# EAGLE design gimli1_1 (EAGLE 7.6.0)
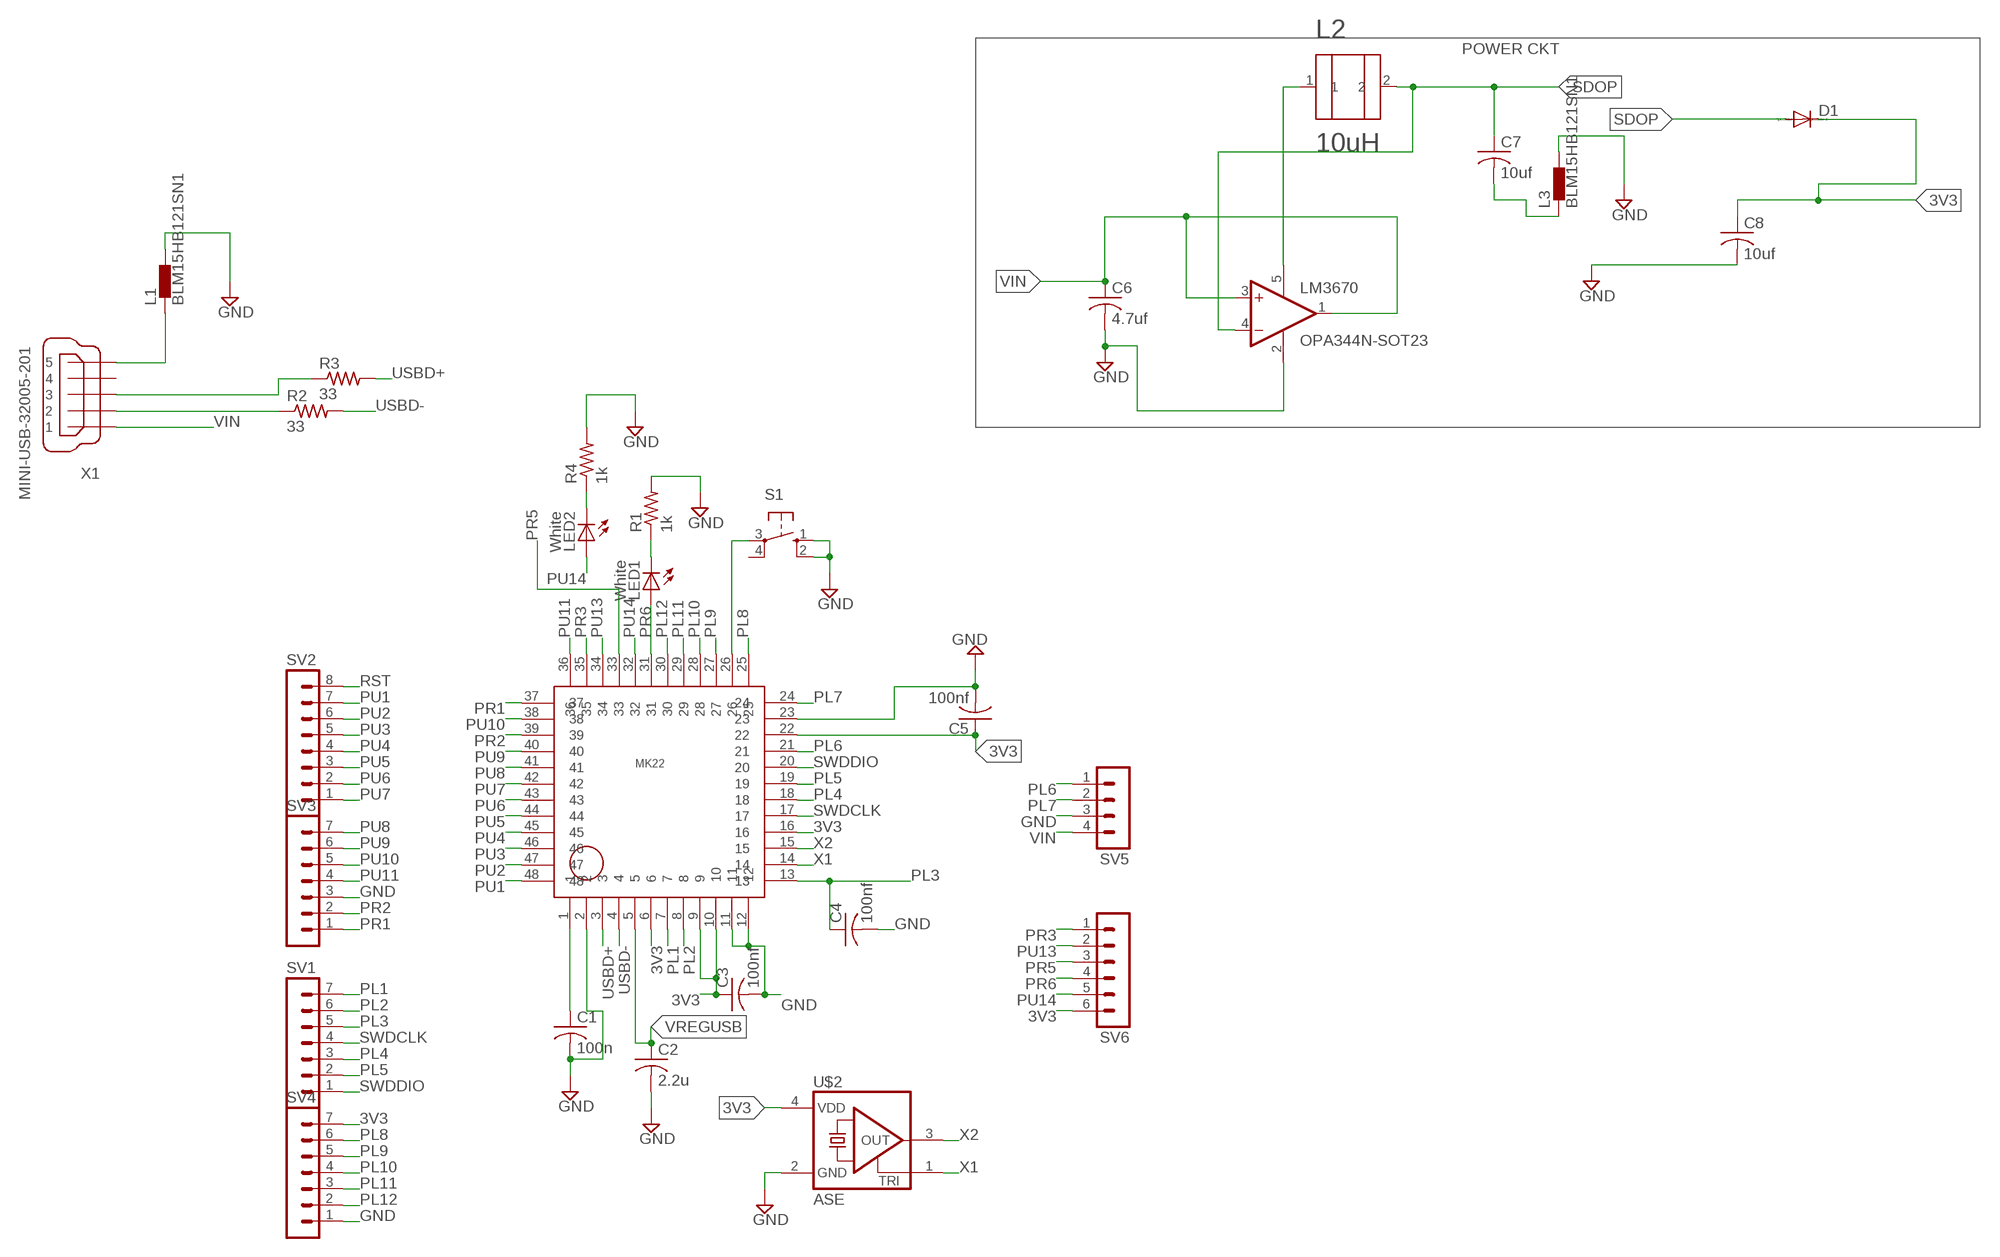
[diagram p0: schematic, sheet 1]

## Parts
C1  100n  C-USC0402  [C0402]
C2  2.2u  C-USC0402  [C0402]
C3  100nf  C-USC0402  [C0402]
C4  100nf  C-USC0402  [C0402]
C5  100nf  C-USC0402  [C0402]
C6  4.7uf  C-USC0402  [C0402]
C7  10uf  C-USC0402  [C0402]
C8  10uf  C-USC0402  [C0402]
D1  DIODE-MICROMELF-W  [MICROMELF-W]
L1  BLM15HB121SN1  [0402]
L2  10uH  INDUCTNEW  [INDUCTNEW]
L3  BLM15HB121SN1  [0402]
LED1  White  LEDSML0603  [SML0603]
LED2  White  LEDSML0603  [SML0603]
LM3670  OPA344N-SOT23  [SOT23-5]
MK22  LQFP48  [LQFP48]
R1  1k  R-US_R0402  [R0402]
R2  33  R-US_R0402  [R0402]
R3  33  R-US_R0402  [R0402]
R4  1k  R-US_R0402  [R0402]
S1  10-XX  [B3F-10XX]
SV1  MA07-1  [MA07-1]
SV2  MA08-1  [MA08-1]
SV3  MA07-1  [MA07-1]
SV4  MA07-1  [MA07-1]
SV5  MA04-1  [MA04-1]
SV6  MA06-1  [MA06-1]
U$2  ASE  [ASE]
X1  MINI-USB-32005-201  [32005-201]

## Nets
3V3: C3.1 C5.1 C8.1 D1.C MK22.6 MK22.9 MK22.10 MK22.16 MK22.22 SV4.7 SV6.6 U$2.4(VDD)
GND: C1.2 C2.2 C3.2 C4.2 C5.2 C6.2 C8.2 L1.1 L1.2 L3.2 LM3670.2(V-) MK22.2 MK22.11 MK22.12 MK22.23 R1.2 R4.2 S1.1(S) S1.2(S1) SV3.3 SV4.1 SV5.3 U$2.2(GND) X1.5
N$1: C1.1 MK22.1
N$3: C7.2 L3.1
N$4: LED1.C R1.1
N$5: LED2.C R4.1
N$6: R2.1 X1.2
N$8: R3.1 X1.3
N$9: L2.1 LM3670.5(V+)
PL1: MK22.7 SV1.7
PL2: MK22.8 SV1.6
PL3: C4.1 MK22.13 SV1.5
PL4: MK22.18 SV1.3
PL5: MK22.19 SV1.2
PL6: MK22.21 SV5.1
PL7: MK22.24 SV5.2
PL8: MK22.25 SV4.6
PL9: MK22.27 SV4.5
PL10: MK22.28 SV4.4
PL11: MK22.29 SV4.3
PL12: MK22.30 SV4.2
PR1: MK22.37 SV3.1
PR2: MK22.39 SV3.2
PR3: MK22.35 SV6.1
PR5: MK22.33 SV6.3
PR6: LED1.A MK22.31 SV6.4
PU1: MK22.48 SV2.7
PU2: MK22.47 SV2.6
PU3: MK22.46 SV2.5
PU4: MK22.45 SV2.4
PU5: MK22.44 SV2.3
PU6: MK22.43 SV2.2
PU7: MK22.42 SV2.1
PU8: MK22.41 SV3.7
PU9: MK22.40 SV3.6
PU10: MK22.38 SV3.5
PU11: MK22.36 SV3.4
PU13: MK22.34 SV6.2
PU14: LED2.A MK22.32 SV6.5
RST: MK22.26 S1.3(P) SV2.8
SDOP: C7.1 D1.A L2.2 LM3670.4(-IN)
SWDCLK: MK22.17 SV1.4
SWDDIO: MK22.20 SV1.1
USBD+: MK22.3 R3.2
USBD-: MK22.4 R2.2
VIN: C6.1 LM3670.1(OUT) LM3670.3(+IN) SV5.4 X1.1
VREGUSB: C2.1 MK22.5
X1: MK22.14 U$2.1(TRI)
X2: MK22.15 U$2.3(OUT)
Unconnected: S1.4(P1) X1.4

## Notes on the sheet
- POWER CKT

## Library data of the parts
C1-C8 = rcl:C-US: CAPACITOR, American symbol
D1 = diode:DIODE-: DIODE
L1 L3 = inductors:BLM15H: EMIFIL (R) Chip Ferrite Bead for GHz Noise Source: http://www.murata.com/ Ferrite Bead BLM15H.pdf
L2 = #rcn-16:INDUCTNEW: This is a power Inductor DFE252012C
LED1 LED2 = led:LED: LED OSRAM: - CHIPLED LG R971, LG N971, LY N971, LG Q971, LY Q971, LO R971, LY R971 LH N974, LH R974 LS Q976, LO Q976, LY Q976 LO Q996 - Hyper CHIPLED LW Q18S LB Q993, LB Q99A, LB R99A - SideLED LS A670, LO A670, LY A670, LG A670, LP A670 LB A673, LV A673, LT A673, LW A673 LH A674 LY A675 LS A676, LA A676, LO A676, LY A676, LW A676 LS A679, LY A679, LG A679 - Hyper Micro SIDELED® LS Y876, LA Y876, LO Y876, LY Y876 LT Y87S - SmartLED LW L88C, LW L88S LB L89C, LB L89S, LG L890 LS L89K, LO L89K, LY L89K LS L896, LA L896, LO L896, LY L896 - TOPLED LS T670, LO T670, LY T670, LG T670, LP T670 LSG T670, LSP T670, LSY T670, LOP T670, LYG T670 LG T671, LOG T671, LSG T671 LB T673, LV T673, LT T673, LW T673 LH T674 LS T676, LA T676, LO T676, LY T676, LB T676, LH T676, LSB T676, LW T676 LB T67C, LV T67C, LT T67C, LS T67K, LO T67K, LY T67K, LW E67C LS E67B, LA E67B, LO E67B, LY E67B, LB E67C, LV E67C, LT E67C LW T67C LS T679, LY T679, LG T679 LS T770, LO T770, LY T770, LG T770, LP T770 LB T773, LV T773, LT T773, LW T773 LH T774 LS E675, LA E675, LY E675, LS T675 LS T776, LA T776, LO T776, LY T776, LB T776 LHGB T686 LT T68C, LB T68C - Hyper Mini TOPLED® LB M676 - Mini TOPLED Santana® LG M470 LS M47K, LO M47K, LY M47K Source: http://www.osram.convergy.de LUXEON: - LUMILED® LXK2-PW12-R00, LXK2-PW12-S00, LXK2-PW14-U00, LXK2-PW14-V00 LXK2-PM12-R00, LXK2-PM12-S00, LXK2-PM14-U00 LXK2-PE12-Q00, LXK2-PE12-R00, LXK2-PE12-S00, LXK2-PE14-T00, LXK2-PE14-U00 LXK2-PB12-K00, LXK2-PB12-L00, LXK2-PB12-M00, LXK2-PB14-N00, LXK2-PB14-P00, LXK2-PB14-Q00 LXK2-PR12-L00, LXK2-PR12-M00, LXK2-PR14-Q00, LXK2-PR14-R00 LXK2-PD12-Q00, LXK2-PD12-R00, LXK2-PD12-S00 LXK2-PH12-R00, LXK2-PH12-S00 LXK2-PL12-P00, LXK2-PL12-Q00, LXK2-PL12-R00 Source: www.luxeon.com KINGBRIGHT: KA-3528ASYC Source: www.kingbright.com
LM3670 = linear:OPA*-SOT23: Single Operational Amplifier Low Power, Single-Supply, Rail-To-Rail Operational Amplifier Source: http://focus.ti.com/lit/ds/symlink/opa2345.pdf
MK22 = nxp_packages:LQFP48
R1-R4 = rcl:R-US_: RESISTOR, American symbol
S1 = switch-omron:10-XX: OMRON SWITCH; MPN: B3F-1000; OC_FARNELL: 176432; OC_NEWARK: 36M3542
SV1 SV3 SV4 = con-lstb:MA07-1: PIN HEADER; OC_FARNELL: unknown; OC_NEWARK: unknown
SV2 = con-lstb:MA08-1: PIN HEADER; OC_FARNELL: unknown; OC_NEWARK: unknown
SV5 = con-lstb:MA04-1: PIN HEADER; OC_FARNELL: unknown; OC_NEWARK: unknown
SV6 = con-lstb:MA06-1: PIN HEADER; OC_FARNELL: unknown; OC_NEWARK: unknown
U$2 = crystal:ASE: 3.3Vdc CMOS SMD CRYSTAL CLOCK OSCILLATOR SOurce: www.abracon.com; OC_FARNELL: unknown; OC_NEWARK: unknown
X1 = con-cypressindustries:MINI-USB-: MINI USB-B Conector Source: www.cypressindustries.com; OC_FARNELL: unknown; OC_NEWARK: unknown

## Board
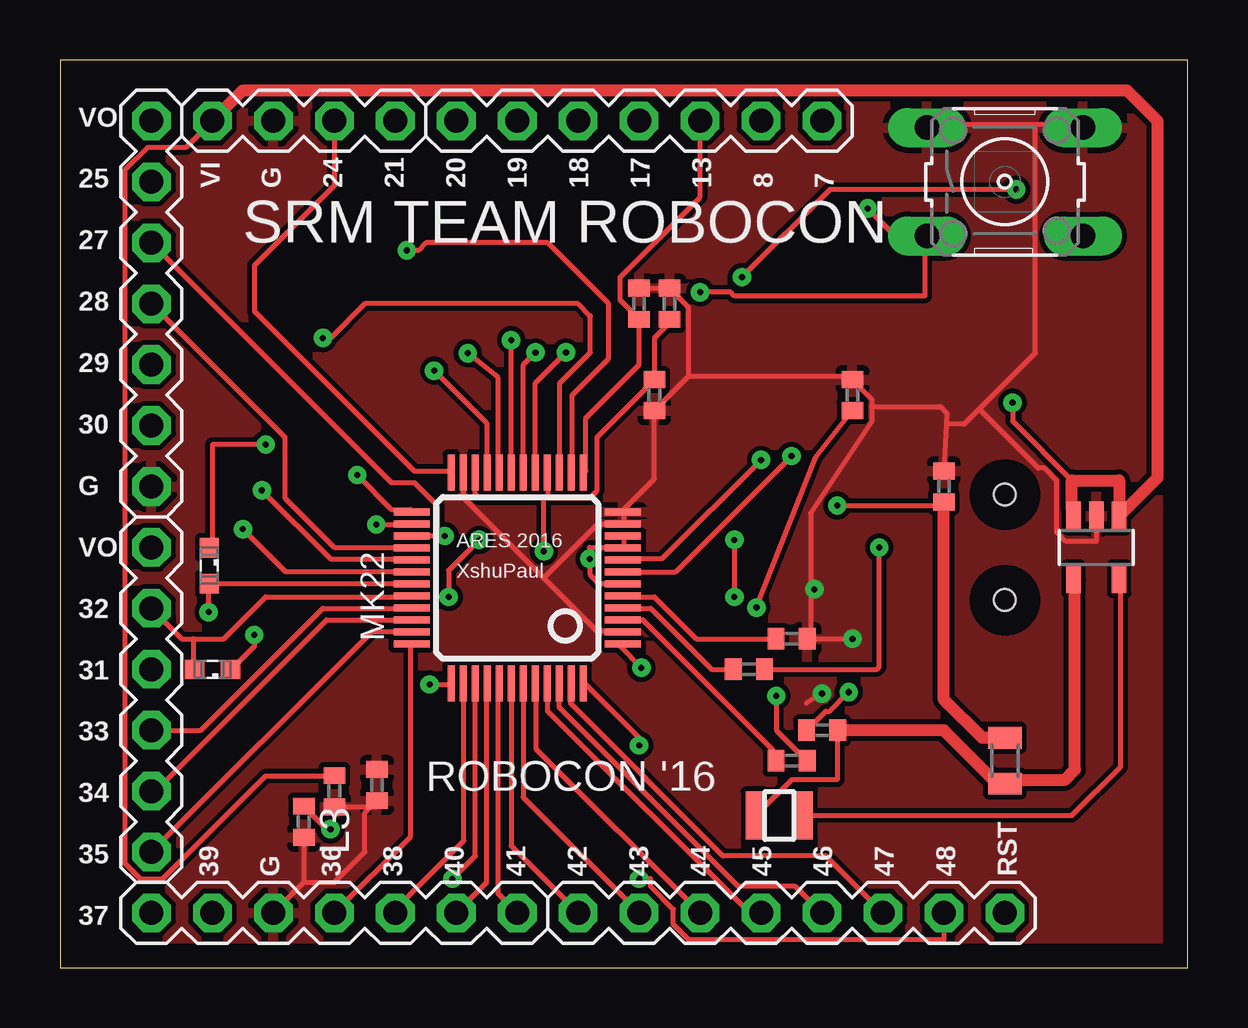
[diagram p1: board, top side]
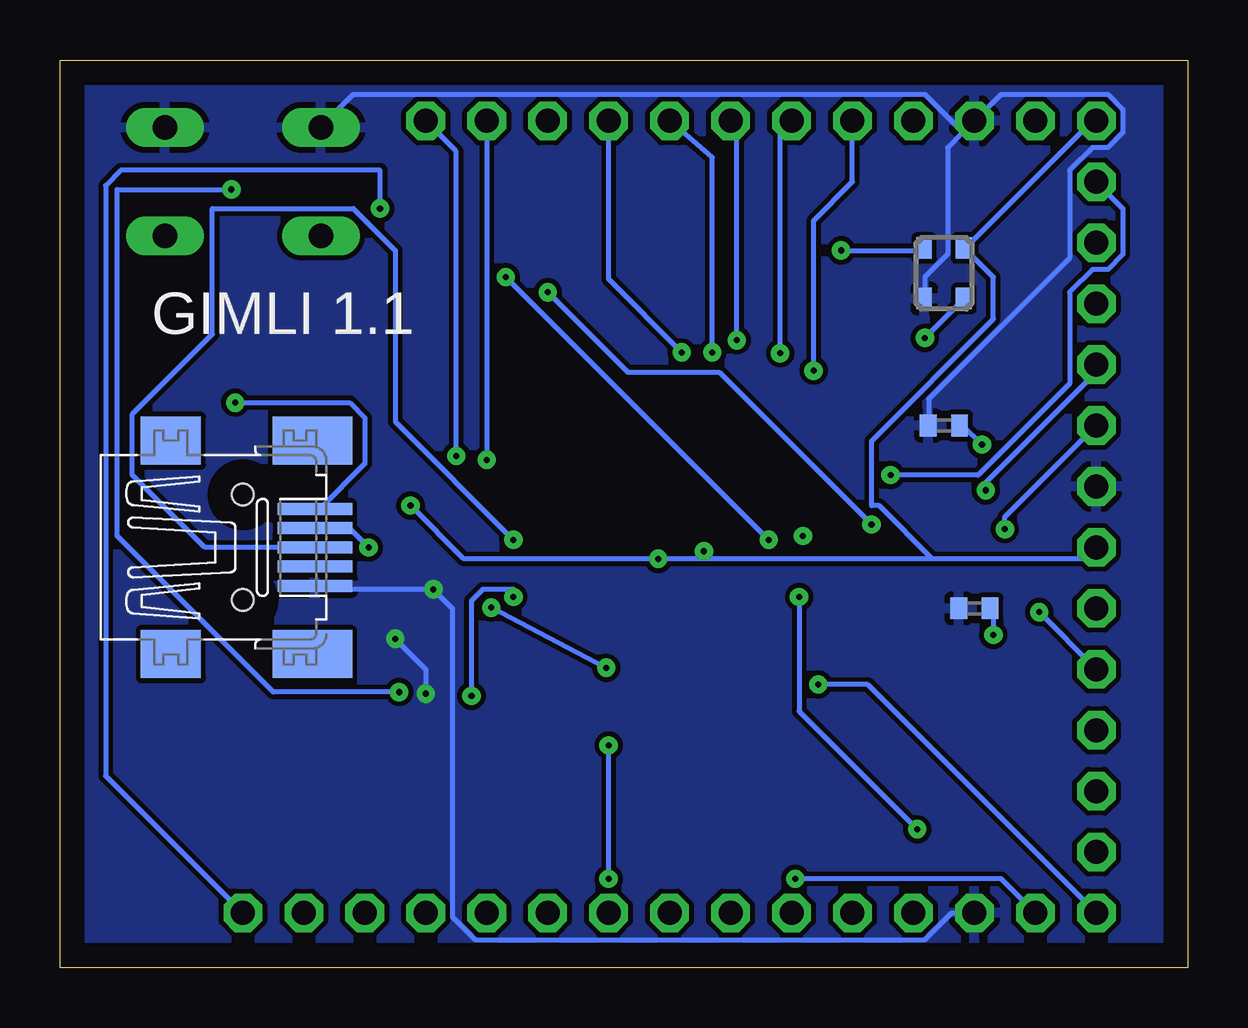
[diagram p2: board, bottom side, seen from below]

Size 46.99 x 37.85 mm. Coordinates in mm from the lower left corner, seen from the top.
Outline: 0,0 46.99,0 46.99,37.85 0,37.85 0,0
Copper layers (1*16): Top 0.035mm / dielectric 1.5mm / Bottom 0.035mm
Design rules "default *": minimum track width 8mil, minimum drill 10mil, track to track 8mil, track to pad 8mil, pad to pad 6mil, via to via 8mil, smd to smd 6mil, copper to edge 40mil, drill to drill 8mil, minimum pad ring 12mil, minimum via ring 10mil, stop-mask expansion 4mil, vias tented up to drill 0mil, thermal gap 10mil

### Footprints (pad centres in the part's own frame; a part is rotated, then mirrored left to right if it is on the bottom)
C0402 = smd 0.7 x 0.9: 1 -0.65,0; 2 0.65,0
MICROMELF-W = smd 0.9 x 1.4: A 0.95,0; C -0.95,0
0402 = smd 0.7 x 0.9: 1 -0.65,0; 2 0.65,0
INDUCTNEW = smd 0.8 x 2: 1 -1,0; 2 1,0
SML0603 = smd 0.8 x 0.8: A 0.75,0; C -0.75,0
SOT23-5 = smd 0.6 x 1.2: 1 -0.95,-1.306; 2 0,-1.306; 3 0.95,-1.306; 4 0.95,1.306; 5 -0.95,1.306
LQFP48 = smd 0.3 x 1.5: 1 -2.75,-4.4; 2 -2.25,-4.4; 3 -1.75,-4.4; 4 -1.25,-4.4; 5 -0.75,-4.4; 6 -0.25,-4.4; 7 0.25,-4.4; 8 0.75,-4.4; 9 1.25,-4.4; 10 1.75,-4.4; 11 2.25,-4.4; 12 2.75,-4.4; 25 2.75,4.4; 26 2.25,4.4; 27 1.75,4.4; 28 1.25,4.4; 29 0.75,4.4; 30 0.25,4.4; 31 -0.25,4.4; 32 -0.75,4.4; 33 -1.25,4.4; 34 -1.75,4.4; 35 -2.25,4.4; 36 -2.75,4.4 | smd 1.5 x 0.3: 13 4.4,-2.75; 14 4.4,-2.25; 15 4.4,-1.75; 16 4.4,-1.25; 17 4.4,-0.75; 18 4.4,-0.25; 19 4.4,0.25; 20 4.4,0.75; 21 4.4,1.25; 22 4.4,1.75; 23 4.4,2.25; 24 4.4,2.75; 37 -4.4,2.75; 38 -4.4,2.25; 39 -4.4,1.75; 40 -4.4,1.25; 41 -4.4,0.75; 42 -4.4,0.25; 43 -4.4,-0.25; 44 -4.4,-0.75; 45 -4.4,-1.25; 46 -4.4,-1.75; 47 -4.4,-2.25; 48 -4.4,-2.75
R0402 = smd 0.7 x 0.9: 1 -0.65,0; 2 0.65,0
B3F-10XX = drill 1.016 long: 1 -3.251,2.261; 2 3.251,2.261; 3 -3.251,-2.261; 4 3.251,-2.261
MA07-1 = drill 1 octagon: 1 -7.62,0; 2 -5.08,0; 3 -2.54,0; 4 0,0; 5 2.54,0; 6 5.08,0; 7 7.62,0
MA08-1 = drill 1 octagon: 1 -8.89,0; 2 -6.35,0; 3 -3.81,0; 4 -1.27,0; 5 1.27,0; 6 3.81,0; 7 6.35,0; 8 8.89,0
MA04-1 = drill 1 octagon: 1 -3.81,0; 2 -1.27,0; 3 1.27,0; 4 3.81,0
MA06-1 = drill 1 octagon: 1 -6.35,0; 2 -3.81,0; 3 -1.27,0; 4 1.27,0; 5 3.81,0; 6 6.35,0
ASE = smd 0.9 x 0.65: 1 -1.05,-0.825; 2 1.05,-0.825; 3 1.05,0.825; 4 -1.05,0.825
32005-201 = smd 3.1 x 0.5: 1 3,1.6; 2 3,0.8; 3 3,0; 4 3,-0.8; 5 3,-1.6 | smd 2.5 x 2: M1 -3,-4.45; M2 -3,4.45 | smd 3.3 x 2: M3 2.9,4.45; M4 2.9,-4.45 | hole 0.9: 0,2.2; 0,-2.2

### Placement (x,y rotation side)
C1  33.02,23.88 90 top
C2  30.48,13.72 0 top
C3  25.4,27.69 90 top
C4  24.13,27.69 90 top
C5  24.77,23.88 270 top
C6  11.43,7.37 270 top
C7  31.75,9.91 180 top
C8  36.83,20.07 90 top
D1  39.37,8.64 270 top
L1  13.21,7.62 270 top
L2  29.97,6.35 180 top
L3  10.16,6.1 270 top
LED1  6.22,16.76 270 top
LED2  6.35,12.45 180 top
LM3670  43.18,17.53 180 top
MK22  19.05,16.26 90 top
R1  10.16,22.61 180 bottom
R2  28.7,12.45 180 top
R3  30.48,8.64 180 top
R4  8.89,14.99 180 bottom
S1  39.37,32.77 0 top
SV1  24.13,35.31 0 top
SV2  30.48,2.29 0 top
SV3  11.43,2.29 0 top
SV4  3.81,27.69 90 top
SV5  10.16,35.31 180 top
SV6  3.81,11.18 90 top
U$2  10.16,28.96 270 bottom
X1  39.37,17.53 0 bottom

### Tracks (layer width: path | path; a pad name or v marks a point on that pad's centre or on a via)
3V3  (via drill 0.25)
  Top 0.203: C3.1 25.4,26.89 24.77,26.26 C5.1 24.77,24.51 22.38,22.13 22.38,19.91 22.07,19.59 20.32,19.59 | MK22.10 23.5,18 23.5,17.53 MK22.9 23.34,17.53 22.07,17.53 v22.07,17.05 22.1,17.02 22.1,16.38 22.48,16.01 MK22.6 | D1.C | 20.32,19.59 20.16,19.59 | 20.16,19.59 17.46,19.59 17.3,19.75 17.3,20.54 MK22.22 | 20.32,19.59 20.32,20.54 MK22.16 | v20.16,17.37 20.16,19.59 | v32.38,19.27 36.83,19.27 C8.1
  Top 0.508: D1.C 38.42,9.59 36.83,11.18 C8.1
  Bottom 0.203: SV4.7 3.97,35.31 9.21,30.07 U$2.4 9.21,29.91 8.1,28.8 8.1,27.05 13.18,21.97 13.18,19.27 12.86,19.27 10.64,17.05 | 10.64,17.05 4.29,17.05 SV6.6 | 10.64,17.05 20.16,17.05 | 20.16,17.05 v22.07,17.05 30.16,17.05 v32.38,19.27 | 20.16,17.05 v20.16,17.37
GND  (via drill 0.25)
  Top 0.203: 25.4,28.32 24.13,28.32 C4.2 | 25.4,28.32 26.19,27.53 26.19,24.67 | 26.19,24.67 24.77,23.24 C5.2 24.77,20.38 23.5,19.11 MK22.12 23.5,18.95 23.5,18.64 MK22.11 23.34,18.48 22.38,18.48 20.16,16.26 | 25.4,28.32 C3.2 | 26.19,24.67 33.02,24.67 C1.2 33.02,24.51 33.81,23.72 33.81,23.4 | 20.16,16.26 22.38,14.03 23.34,14.03 MK22.2 | 20.16,16.26 16.83,19.59 16.83,20.54 MK22.23 | 40.64,35.15 42.55,35.15 S1.2 | 40.64,35.15 36.2,35.15 S1.1 | 31.27,15.78 31.27,18.95 33.81,22.76 33.81,23.4 | 31.27,15.78 31.27,13.72 C2.2 v33.02,13.72 | 33.81,23.4 36.67,23.4 36.96,23.11 36.93,22.67 | 36.93,22.67 C8.2 | 31.27,15.78 v31.43,15.78 | 40.64,35.15 40.64,25.62 38.31,23.29 | v31.75,11.43 31.1,11.03 | 38.31,23.29 37.69,22.67 36.93,22.67 | SV3.3 10.16,3.56 | 10.16,3.56 11.43,3.56 12.7,4.83 12.7,6.46 L1.2 13.21,6.72 C6.2 | L3.2 10.16,3.56 | LM3670.2 43.18,17.78 41.91,17.78 41.53,18.16 41.53,20.32 41.02,20.83 40.77,20.83 38.31,23.29
  Bottom 0.203: 9.37,34.83 10,34.2 10,29.75 10.95,28.8 10.95,28 U$2.2 | R1.2 10.79,22.61 10.79,23.72 4.92,29.59 4.92,33.24 3.97,34.2 3.33,34.2 2.7,34.83 2.7,35.78 3.33,36.42 7.78,36.42 SV5.3 9.37,34.83 | X1.5 36.35,15.78 v31.43,15.78 30.64,14.99 30.64,2.13 29.69,1.18 10.95,1.18 9.84,2.29 SV3.3 | 9.37,34.83 10.95,36.42 34.77,36.42 36.04,35.15 S1.1 | v33.02,13.72 31.75,12.45 v31.75,11.43
  pour Top: 0,0 0,37.85 46.99,37.85 46.99,0
  pour Bottom: 0,0 0,37.85 46.99,37.85 46.99,0
N$1  (via drill 0.25)
  Top 0.203: v29.02,15.02 31.5,21.3 C1.1 | v24.23,12.51 23.34,13.4 MK22.1
  Bottom 0.203: v24.23,12.51 v29.02,15.02
N$3  (via drill 0.25)
  Top 0.203: v11.27,5.78 11.11,5.78 10.16,6.73 L3.1 | v16.19,15.46 16.19,16.57 v17.46,17.84 | v28.42,28.8 32.07,32.45 v39.85,32.45 | v32.86,11.49 32.07,10.7 31.91,10.7 31.11,9.91 C7.2
  Bottom 0.203: v11.27,5.78 16.19,10.7 v16.19,15.46 | v28.42,28.8 v17.46,17.84 | v39.85,32.45 44.61,32.45 44.61,18 38.1,11.49 v32.86,11.49
N$4  (via drill 0.25)
  Top 0.203: v8.57,21.81 6.35,21.81 6.35,17.53 LED1.C
  Bottom 0.203: v8.57,21.81 9.37,22.61 R1.1
N$5  (via drill 0.25)
  Top 0.203: v8.1,13.88 8.1,13.4 7.14,12.45 LED2.C
  Bottom 0.203: v8.1,13.88 8.1,14.99 R4.1
N$6  (via drill 0.25)
  Top 0.203: R2.1 34.04,12.45 34.13,12.54 v34.13,17.53
  Bottom 0.203: v34.13,17.53 34.92,18.32 36.35,18.32 X1.2
N$8  (via drill 0.25)
  Top 0.203: v29.84,11.34 29.84,9.91 31.11,8.64 R3.1 | v28.1,17.84 v28.1,15.46
  Bottom 0.203: v29.84,11.34 29.84,15.3 29.37,15.78 28.1,15.78 v28.1,15.46 | v28.1,17.84 33.02,22.76 33.02,29.91 34.77,31.65 40.64,31.65 40.64,26.42 43.97,23.08 43.97,20.54 40.96,17.53 X1.3
N$9
  Top 0.203: L2.1 42.16,6.35 44.2,8.38 44.2,16.15 LM3670.5
PL1  (via drill 0.25)
  Top 0.203: MK22.7 25.65,16.51 v30.48,21.34
  Bottom 0.203: v30.48,21.34 30.48,34.04 SV1.7
PL2  (via drill 0.25)
  Top 0.203: v29.21,21.18 25.08,17.05 23.5,17.05 MK22.8
  Bottom 0.203: SV1.6 v29.21,21.18
PL3
  Top 0.203: MK22.13 21.91,20.7 21.91,22.92 24.13,25.15 C4.1 24.13,27.05 23.34,27.84 23.34,28.8 26.67,32.13 SV1.5
PL4  (via drill 0.25)
  Top 0.203: MK22.18 19.3,25.15 v19.81,25.65
  Bottom 0.203: v19.81,25.65 19.81,33.78 SV1.3
PL5  (via drill 0.25)
  Top 0.203: MK22.19 18.8,23.62 v18.8,26.16
  Bottom 0.203: v18.8,26.16 18.8,35.05 SV1.2
PL6  (via drill 0.25)
  Top 0.203: v15.59,24.89 17.78,22.7 17.78,20.7 MK22.21
  Bottom 0.203: v15.59,24.89 15.59,31.15 13.97,32.77 SV5.1
PL7
  Top 0.203: SV5.2 11.43,32.61 8.1,29.27 8.1,27.37 14.76,20.7 16.19,20.7 MK22.24
PL8  (via drill 0.25)
  Top 0.203: v12.38,20.54 13.81,19.11 14.61,19.11 MK22.25
  Bottom 0.203: SV4.6 2.7,31.65 2.7,29.75 3.33,29.11 3.97,29.11 4.92,28.16 4.92,24.35 8.73,20.54 v12.38,20.54
PL9  (via drill 0.25)
  Top 0.203: 15.72,18 14.76,18 MK22.27 | 15.72,18 15.72,19.27 14.76,20.22 13.81,20.22 SV4.5 | 15.72,18 v16.03,18
PL10
  Top 0.203: SV4.4 9.37,22.13 9.37,19.59 11.43,17.53 14.61,17.53 MK22.28
PL11  (via drill 0.25)
  Top 0.203: v8.41,19.91 11.27,17.05 14.61,17.05 MK22.29
  Bottom 0.203: v8.41,19.91 8.41,20.22 3.81,24.83 SV4.3
PL12  (via drill 0.25)
  Top 0.203: MK22.30 9.4,16.51 v7.62,18.29
  Bottom 0.203: v7.62,18.29 7.62,18.8 SV4.2
PR1  (via drill 0.25)
  Top 0.203: v15.4,11.81 16.19,11.81 MK22.37
  Bottom 0.203: v15.4,11.81 13.34,11.81 SV3.1
PR2  (via drill 0.25)
  Top 0.203: v16.35,3.71 17.3,4.67 17.3,11.81 MK22.39
  Bottom 0.203: v16.35,3.71 7.78,3.71 SV3.2
PR3
  Top 0.203: SV6.1 13.02,14.03 14.61,14.03 MK22.35
PR5
  Top 0.203: SV6.3 5.87,9.91 10.95,14.99 14.61,14.99 MK22.33
PR6  (via drill 0.25)
  Top 0.203: v6.19,14.83 6.19,15.94 LED1.A MK22.31
  Bottom 0.203: SV6.4 v6.19,14.83
PU1  (via drill 0.25)
  Top 0.203: v24.13,9.27 24.13,9.59 21.91,11.81 MK22.48 | v24.13,3.71 24.61,3.71 24.61,3.4 25.56,2.44 25.56,1.81 26.19,1.18 36.83,1.18 SV2.7
  Bottom 0.203: v24.13,3.71 v24.13,9.27
PU2
  Top 0.203: SV2.6 31.91,4.67 27.62,4.67 21.27,11.02 21.27,11.81 MK22.47
PU3
  Top 0.203: SV2.5 30.64,3.4 28.26,3.4 20.8,10.86 20.8,11.81 MK22.46
PU4
  Top 0.203: SV2.4 28.73,2.29 20.32,10.7 20.32,11.81 MK22.45
PU5
  Top 0.203: SV2.3 19.84,9.11 19.84,11.81 MK22.44
PU6
  Top 0.203: MK22.43 19.3,7.12 SV2.2
PU7
  Top 0.203: MK22.42 18.8,5.08 SV2.1
PU8
  Top 0.203: SV3.7 18.26,3.08 18.26,11.81 MK22.41
PU9
  Top 0.203: SV3.6 17.78,3.56 17.78,11.81 MK22.40
PU10
  Top 0.203: SV3.5 13.97,2.44 16.83,5.3 16.83,11.81 MK22.38
PU11
  Top 0.203: SV3.4 14.61,5.46 14.61,13.4 MK22.36
PU13
  Top 0.203: SV6.2 3.97,7.37 11.11,14.51 14.61,14.51 MK22.34
PU14
  Top 0.203: 5.56,13.72 5.08,13.72 SV6.5 | 5.56,13.72 6.83,13.72 8.57,15.46 14.61,15.46 MK22.32 | 5.56,13.72 5.56,12.45 LED2.A
RST  (via drill 0.25)
  Top 0.203: v13.18,18.48 14.61,18.48 MK22.26 | v26.67,28.16 27.94,28.16 28.1,28 36.04,28 36.04,30.38 S1.3 36.04,30.54 34.77,30.54 v33.66,31.65
  Bottom 0.203: v13.18,18.48 19.53,24.83 23.34,24.83 v26.67,28.16 | SV2.8 45.09,8 45.09,32.61 44.45,33.24 33.66,33.24 v33.66,31.65
SDOP
  Top 0.203: 42.23,16.1 LM3670.4 | 39.37,7.84 D1.A | L2.2 29.05,6.41 30.48,7.84 32.38,7.84 32.38,9.91 C7.1
  Top 0.508: C7.1 36.83,9.91 38.89,7.84 39.37,7.84 41.88,7.84 42.29,8.26 42.29,16.16 LM3670.4
SWDCLK  (via drill 0.25)
  Top 0.203: MK22.17 19.81,20.67 19.81,24.38 v21.08,25.65
  Bottom 0.203: v21.08,25.65 24.13,28.7 SV1.4
SWDDIO  (via drill 0.25)
  Top 0.203: MK22.20 18.26,20.7 18.26,24.61 v16.99,25.62
  Bottom 0.203: v16.99,25.62 16.99,34.83 SV1.1
USBD+
  Top 0.203: R3.2 29.69,8.64 29.69,9.11 24.29,14.51 23.5,14.51 MK22.3
USBD-
  Top 0.203: MK22.4 23.5,14.99 24.61,14.99 27.15,12.45 R2.2
VIN  (via drill 0.25)
  Top 0.203: 42.39,18.95 LM3670.3 | SV5.4 5.24,34.2 3.65,34.2 2.7,33.24 2.7,4.35 3.33,3.71 4.29,3.71 8.57,8 11.43,8 C6.1 | v39.69,23.56 39.69,22.8 42.16,20.32 | 43.97,18.95 43.97,18.99 LM3670.1 43.97,18.95
  Top 0.508: SV5.4 7.62,36.58 44.45,36.58 45.72,35.31 45.72,20.42 LM3670.1 44.13,20.32 42.16,20.32 42.16,19.12 42.23,19.12 LM3670.3
  Bottom 0.203: v39.69,23.56 34.92,23.56 34.29,22.92 34.29,21.02 36.2,19.11 X1.1
VREGUSB
  Top 0.203: C2.1 26.51,13.72 24.77,15.46 23.5,15.46 MK22.5
X1  (via drill 0.25)
  Top 0.203: MK22.14 21.27,20.7 21.34,20.76 21.34,23.88 22.86,25.4 22.86,27.69 20.32,30.23 15.24,30.23 14.92,29.91 v14.45,29.91
  Bottom 0.203: v14.45,29.91 11.11,29.91 U$2.1
X2  (via drill 0.25)
  Top 0.203: MK22.15 20.8,20.7 20.83,20.73 20.83,24.38 22.1,25.65 22.1,27.18 21.59,27.69 12.7,27.69 11.27,26.26 v10.95,26.26
  Bottom 0.203: v10.95,26.26 9.37,27.84 U$2.3

### Text on the board
tNames: VI / G / 24 / 21 / 20 / 19 / 18 / 17 / 13 / 8 / 7 | SRM TEAM ROBOCON | ARES 2016 | XshuPaul | ROBOCON '16 | 39 / G / 36 / 38 / 40 / 41 / 42 / 43 / 44 / 45 / 46 / 47 / 48 / RST | VO / 25 / 27 / 28 / 29 / 30 / G / VO / 32 / 31 / 33 / 34 / 35 / 37
bNames: GIMLI 1.1